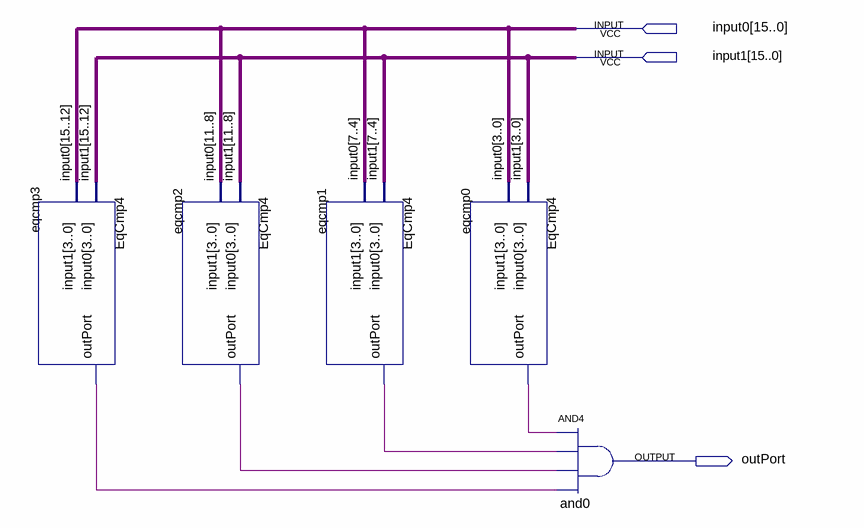
[diagram p0: schematic sheet]
// Quartus schematic EqCmp16.bdf as structural Verilog: 5 symbols, 3 pins
module EqCmp16 (
  input  [15:0] input0,
  input  [15:0] input1,
  output outPort
);

  wire eqcmp0_outport, eqcmp1_outport, eqcmp2_outport, eqcmp3_outport;

  EqCmp4 eqcmp3 (.input0(input1[15:12]), .input1(input0[15:12]), .outPort(eqcmp3_outport));
  EqCmp4 eqcmp2 (.input0(input1[11:8]), .input1(input0[11:8]), .outPort(eqcmp2_outport));
  EqCmp4 eqcmp1 (.input0(input1[7:4]), .input1(input0[7:4]), .outPort(eqcmp1_outport));
  EqCmp4 eqcmp0 (.input0(input1[3:0]), .input1(input0[3:0]), .outPort(eqcmp0_outport));
  and and0 (outPort, eqcmp0_outport, eqcmp1_outport, eqcmp2_outport, eqcmp3_outport);
endmodule
